# EAGLE design 6309 CPU Card v1 (EAGLE 4.16)
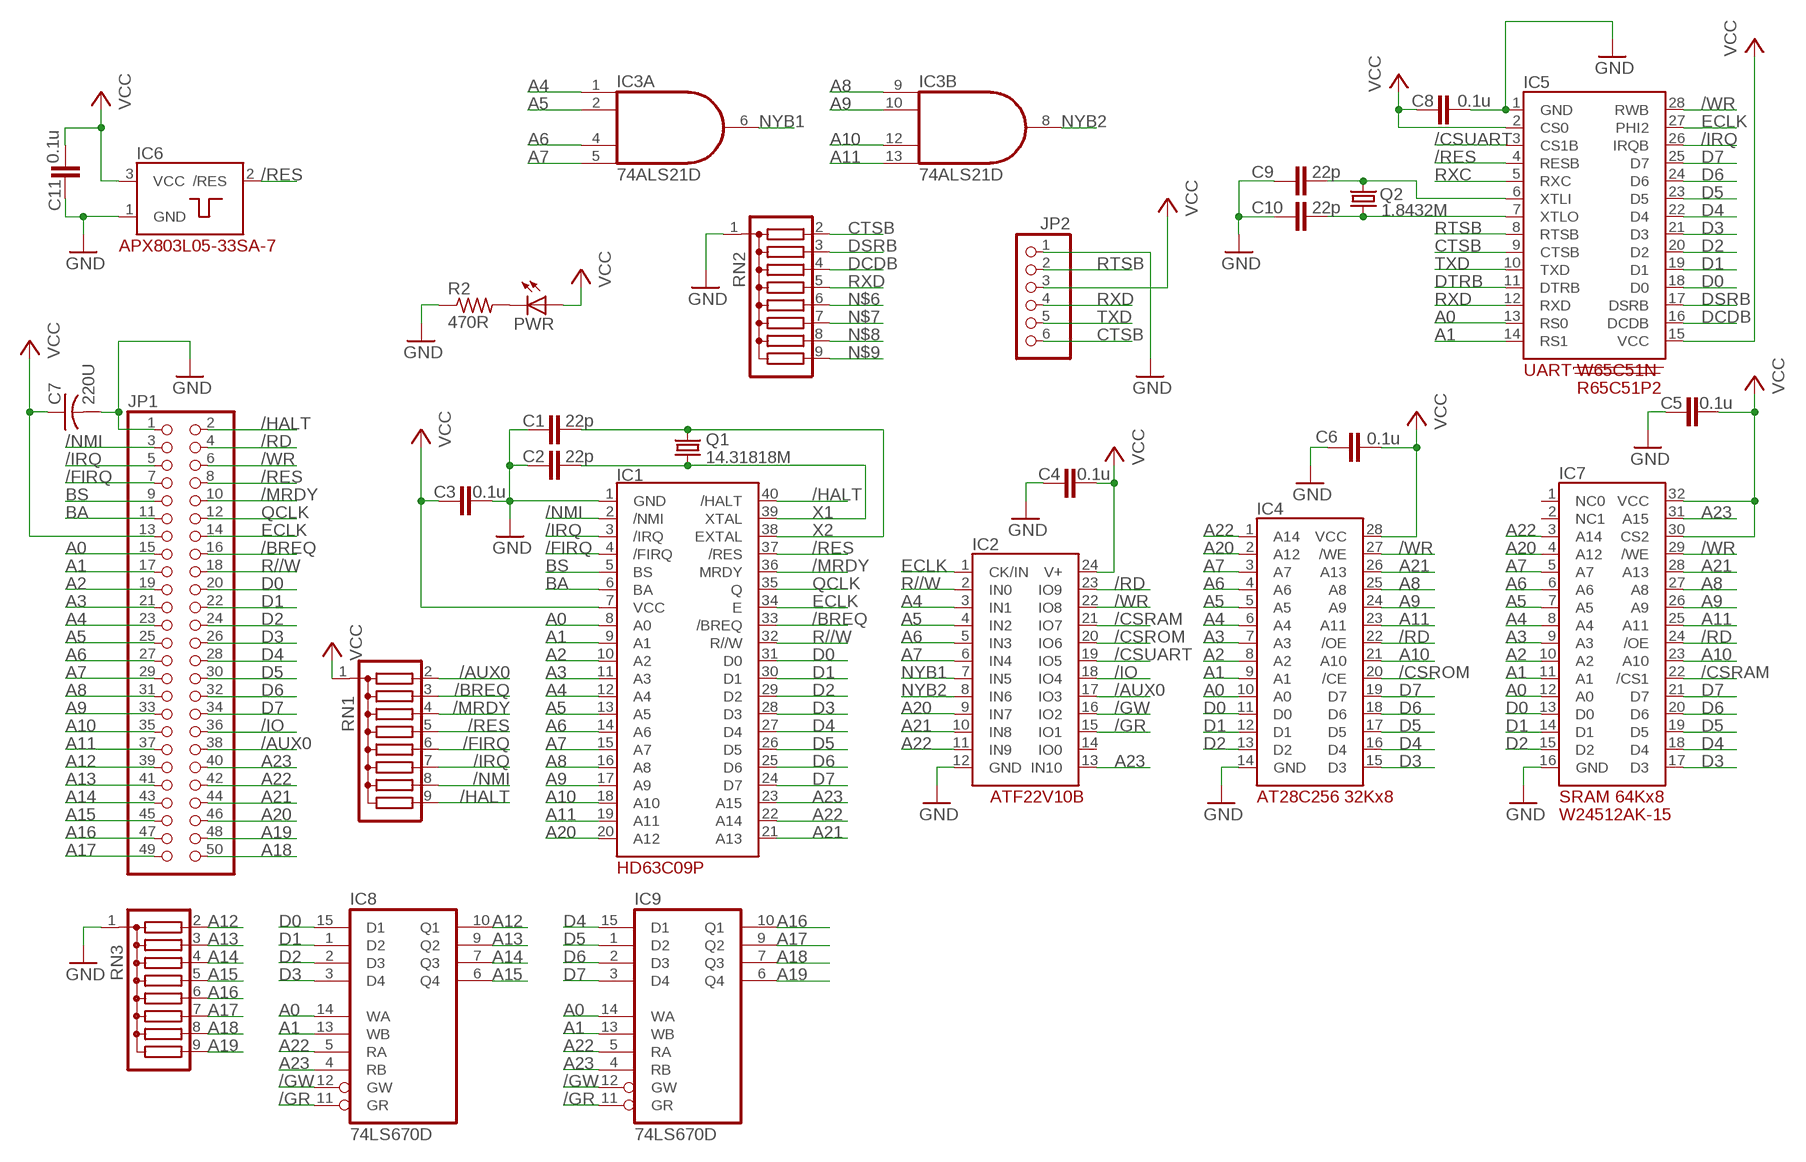
[diagram p0: schematic, sheet 1]

## Parts
C1  22p  C-EUC0603  [C0603]
C2  22p  C-EUC0603  [C0603]
C3  0.1u  C-EUC0603  [C0603]
C4  0.1u  C-EUC0603  [C0603]
C5  0.1u  C-EUC0603  [C0603]
C6  0.1u  C-EUC0603  [C0603]
C7  220U  C-US025-050X050  [C025-050X050]
C8  0.1u  C-EUC0603  [C0603]
C9  22p  C-EUC0603  [C0603]
C10  22p  C-EUC0603  [C0603]
C11  0.1u  C-EUC0603  [C0603]
IC1  HD63C09P  [DIL40]
IC2  PLD_ATF22V10B  [DIL24-3]
IC3  74ALS21D  [SO14]
IC4  EEP_32KX8_AT28C256  [DIL28-6]
IC5  UART_W65C51N  [DIL28-6]
IC6  POR_APX803L05-33SA-7  [SOT23]
IC7  SRAM_64KX8_W24512AK-15  [DIL32-3]
IC8  74LS670D  [SO16]
IC9  74LS670D  [SO16]
JP1  PINHD-2X25  [2X25]
JP2  PINHD-1X6  [1X06]
PWR  LED3MM  [LED3MM]
Q1  14.31818M  CRYSTALHC49S  [HC49/S]
Q2  1.8432M  CRYSTALHC49U-H  [HC49U-H]
R2  470R  R-US_R0603  [R0603]
RN1  G08R  [SIL9]
RN2  G08R  [SIL9]
RN3  G08R  [SIL9]

## Nets
/AUX0: IC2.17(IO3) JP1.38 RN1.2
/BREQ: IC1.33(/BREQ) JP1.16 RN1.3
/CSRAM: IC2.21(IO7) IC7.22(/CS1)
/CSROM: IC2.20(IO6) IC4.20(/CE)
/CSUART: IC2.19(IO5) IC5.3(CS1B)
/FIRQ: IC1.4(/FIRQ) JP1.7 RN1.6
/GR: IC2.15(IO1) IC8.11(GR) IC9.11(GR)
/GW: IC2.16(IO2) IC8.12(GW) IC9.12(GW)
/HALT: IC1.40(/HALT) JP1.2 RN1.9
/IO: IC2.18(IO4) JP1.36
/IRQ: IC1.3(/IRQ) IC5.26(IRQB) JP1.5 RN1.7
/MRDY: IC1.36(MRDY) JP1.10 RN1.4
/NMI: IC1.2(/NMI) JP1.3 RN1.8
/RD: IC2.23(IO9) IC4.22(/OE) IC7.24(/OE) JP1.4
/RES: IC1.37(/RES) IC5.4(RESB) IC6.2(/RES) JP1.8 RN1.5
/WR: IC2.22(IO8) IC4.27(/WE) IC5.28(RWB) IC7.29(/WE) JP1.6
A0: IC1.8(A0) IC4.10(A0) IC5.13(RS0) IC7.12(A0) IC8.14(WA) IC9.14(WA) JP1.15
A1: IC1.9(A1) IC4.9(A1) IC5.14(RS1) IC7.11(A1) IC8.13(WB) IC9.13(WB) JP1.17
A2: IC1.10(A2) IC4.8(A2) IC7.10(A2) JP1.19
A3: IC1.11(A3) IC4.7(A3) IC7.9(A3) JP1.21
A4: IC1.12(A4) IC2.3(IN1) IC3.1(A:I0) IC4.6(A4) IC7.8(A4) JP1.23
A5: IC1.13(A5) IC2.4(IN2) IC3.2(A:I1) IC4.5(A5) IC7.7(A5) JP1.25
A6: IC1.14(A6) IC2.5(IN3) IC3.4(A:I2) IC4.4(A6) IC7.6(A6) JP1.27
A7: IC1.15(A7) IC2.6(IN4) IC3.5(A:I3) IC4.3(A7) IC7.5(A7) JP1.29
A8: IC1.16(A8) IC3.9(B:I0) IC4.25(A8) IC7.27(A8) JP1.31
A9: IC1.17(A9) IC3.10(B:I1) IC4.24(A9) IC7.26(A9) JP1.33
A10: IC1.18(A10) IC3.12(B:I2) IC4.21(A10) IC7.23(A10) JP1.35
A11: IC1.19(A11) IC3.13(B:I3) IC4.23(A11) IC7.25(A11) JP1.37
A12: IC8.10(Q1) JP1.39 RN3.2
A13: IC8.9(Q2) JP1.41 RN3.3
A14: IC8.7(Q3) JP1.43 RN3.4
A15: IC8.6(Q4) JP1.45 RN3.5
A16: IC9.10(Q1) JP1.47 RN3.6
A17: IC9.9(Q2) JP1.49 RN3.7
A18: IC9.7(Q3) JP1.50 RN3.8
A19: IC9.6(Q4) JP1.48 RN3.9
A20: IC1.20(A12) IC2.9(IN7) IC4.2(A12) IC7.4(A12) JP1.46
A21: IC1.21(A13) IC2.10(IN8) IC4.26(A13) IC7.28(A13) JP1.44
A22: IC1.22(A14) IC2.11(IN9) IC4.1(A14) IC7.3(A14) IC8.5(RA) IC9.5(RA) JP1.42
A23: IC1.23(A15) IC2.13(IN10) IC7.31(A15) IC8.4(RB) IC9.4(RB) JP1.40
BA: IC1.6(BA) JP1.11
BS: IC1.5(BS) JP1.9
CTSB: IC5.9(CTSB) JP2.6 RN2.2
D0: IC1.31(D0) IC4.11(D0) IC5.18(D0) IC7.13(D0) IC8.15(D1) JP1.20
D1: IC1.30(D1) IC4.12(D1) IC5.19(D1) IC7.14(D1) IC8.1(D2) JP1.22
D2: IC1.29(D2) IC4.13(D2) IC5.20(D2) IC7.15(D2) IC8.2(D3) JP1.24
D3: IC1.28(D3) IC4.15(D3) IC5.21(D3) IC7.17(D3) IC8.3(D4) JP1.26
D4: IC1.27(D4) IC4.16(D4) IC5.22(D4) IC7.18(D4) IC9.15(D1) JP1.28
D5: IC1.26(D5) IC4.17(D5) IC5.23(D5) IC7.19(D5) IC9.1(D2) JP1.30
D6: IC1.25(D6) IC4.18(D6) IC5.24(D6) IC7.20(D6) IC9.2(D3) JP1.32
D7: IC1.24(D7) IC4.19(D7) IC5.25(D7) IC7.21(D7) IC9.3(D4) JP1.34
DCDB: IC5.16(DCDB) RN2.4
DSRB: IC5.17(DSRB) RN2.3
DTRB: IC5.11(DTRB)
ECLK: IC1.34(E) IC2.1(CK/IN) IC5.27(PHI2) JP1.14
GND [supply]: C1.1 C2.1 C3.2 C4.1 C5.1 C6.1 C7.2 C8.2 C9.1 C10.1 C11.2 IC1.1(GND) IC2.12(GND) IC4.14(GND) IC5.1(GND) IC6.1(GND) IC7.16(GND) JP1.1 JP2.1 R2.1 RN2.1 RN3.1
N$2: PWR.K(C) R2.2
N$6: RN2.6
N$7: RN2.7
N$8: RN2.8
N$9: RN2.9
N$20: C9.2 IC5.6(XTLI) Q2.2
N$21: C10.2 IC5.7(XTLO) Q2.1
NYB1: IC2.7(IN5) IC3.6(A:O)
NYB2: IC2.8(IN6) IC3.8(B:O)
QCLK: IC1.35(Q) JP1.12
R//W: IC1.32(R//W) IC2.2(IN0) JP1.18
RTSB: IC5.8(RTSB) JP2.2
RXC: IC5.5(RXC)
RXD: IC5.12(RXD) JP2.4 RN2.5
TXD: IC5.10(TXD) JP2.5
VCC [supply]: C3.1 C4.2 C5.2 C6.2 C7.1 C8.1 C11.1 IC1.7(VCC) IC2.24(V+) IC4.28(VCC) IC5.2(CS0) IC5.15(VCC) IC6.3(VCC) IC7.30(CS2) IC7.32(VCC) JP1.13 JP2.3 PWR.A RN1.1
X1: C2.2 IC1.39(XTAL) Q1.1
X2: C1.2 IC1.38(EXTAL) Q1.2
Unconnected: IC2.14(IO0) IC7.1(NC0) IC7.2(NC1)

## Notes on the sheet
- R65C51P2

## Power pins joined to a net without a drawn wire
GND: IC3.7(P:GND) IC8.8(GND) IC9.8(GND)
VCC: IC3.14(P:VCC) IC8.16(VCC) IC9.16(VCC)

## Library data of the parts
C1-C6 C8-C11 = rcl:C-EU: CAPACITOR, European symbol
C7 = rcl:C-US: CAPACITOR, American symbol
IC1 = 07-Retrocomputing:HD63C09P
IC2 = 07-Retrocomputing:PLD_ATF22V10B
IC3 = 74xx-us:74*21: Dual 4-input AND gate
IC4 = 07-Retrocomputing:EEP_32KX8_AT28C256
IC5 = 07-Retrocomputing:UART_W65C51N
IC6 = 07-Retrocomputing:POR_APX803L05-33SA-7
IC7 = 07-Retrocomputing:SRAM_64KX8_W24512AK-15
IC8 IC9 = 74xx-us:74*670: 4 by 4 REGISTER FILES, 3-state
JP1 = pinhead:PINHD-2X25: PIN HEADER
JP2 = pinhead:PINHD-1X6: PIN HEADER
PWR = led:LED: LED OSRAM: - CHIPLED LG R971, LG N971, LY N971, LG Q971, LY Q971, LO R971, LY R971 LH N974, LH R974 LS Q976, LO Q976, LY Q976 LO Q996 - Hyper CHIPLED LW Q18S LB Q993, LB Q99A, LB R99A - SideLED LS A670, LO A670, LY A670, LG A670, LP A670 LB A673, LV A673, LT A673, LW A673 LH A674 LY A675 LS A676, LA A676, LO A676, LY A676, LW A676 LS A679, LY A679, LG A679 - Hyper Micro SIDELED® LS Y876, LA Y876, LO Y876, LY Y876 LT Y87S - SmartLED LW L88C, LW L88S LB L89C, LB L89S, LG L890 LS L89K, LO L89K, LY L89K LS L896, LA L896, LO L896, LY L896 - TOPLED LS T670, LO T670, LY T670, LG T670, LP T670 LSG T670, LSP T670, LSY T670, LOP T670, LYG T670 LG T671, LOG T671, LSG T671 LB T673, LV T673, LT T673, LW T673 LH T674 LS T676, LA T676, LO T676, LY T676, LB T676, LH T676, LSB T676, LW T676 LB T67C, LV T67C, LT T67C, LS T67K, LO T67K, LY T67K, LW E67C LS E67B, LA E67B, LO E67B, LY E67B, LB E67C, LV E67C, LT E67C LW T67C LS T679, LY T679, LG T679 LS T770, LO T770, LY T770, LG T770, LP T770 LB T773, LV T773, LT T773, LW T773 LH T774 LS E675, LA E675, LY E675, LS T675 LS T776, LA T776, LO T776, LY T776, LB T776 LHGB T686 LT T68C, LB T68C - Hyper Mini TOPLED® LB M676 - Mini TOPLED Santana® LG M470 LS M47K, LO M47K, LY M47K Source: http://www.osram.convergy.de - LUMILED® LXK2-PW12-R00, LXK2-PW12-S00, LXK2-PW14-U00, LXK2-PW14-V00 LXK2-PM12-R00, LXK2-PM12-S00, LXK2-PM14-U00 LXK2-PE12-Q00, LXK2-PE12-R00, LXK2-PE12-S00, LXK2-PE14-T00, LXK2-PE14-U00 LXK2-PB12-K00, LXK2-PB12-L00, LXK2-PB12-M00, LXK2-PB14-N00, LXK2-PB14-P00, LXK2-PB14-Q00 LXK2-PR12-L00, LXK2-PR12-M00, LXK2-PR14-Q00, LXK2-PR14-R00 LXK2-PD12-Q00, LXK2-PD12-R00, LXK2-PD12-S00 LXK2-PH12-R00, LXK2-PH12-S00 LXK2-PL12-P00, LXK2-PL12-Q00, LXK2-PL12-R00 Source: www.luxeon.com
Q1 Q2 = crystal:CRYSTAL: CRYSTAL
R2 = rcl:R-US_: RESISTOR, American symbol
RN1-RN3 = resistor-sil:G08R: SIL RESISTOR

## Net classes
0 default: width 0.203 mm, drill 0.203 mm, clearance 0.254 mm
1 supply: width 0.61 mm, drill 0.203 mm, clearance 0.305 mm

## Board
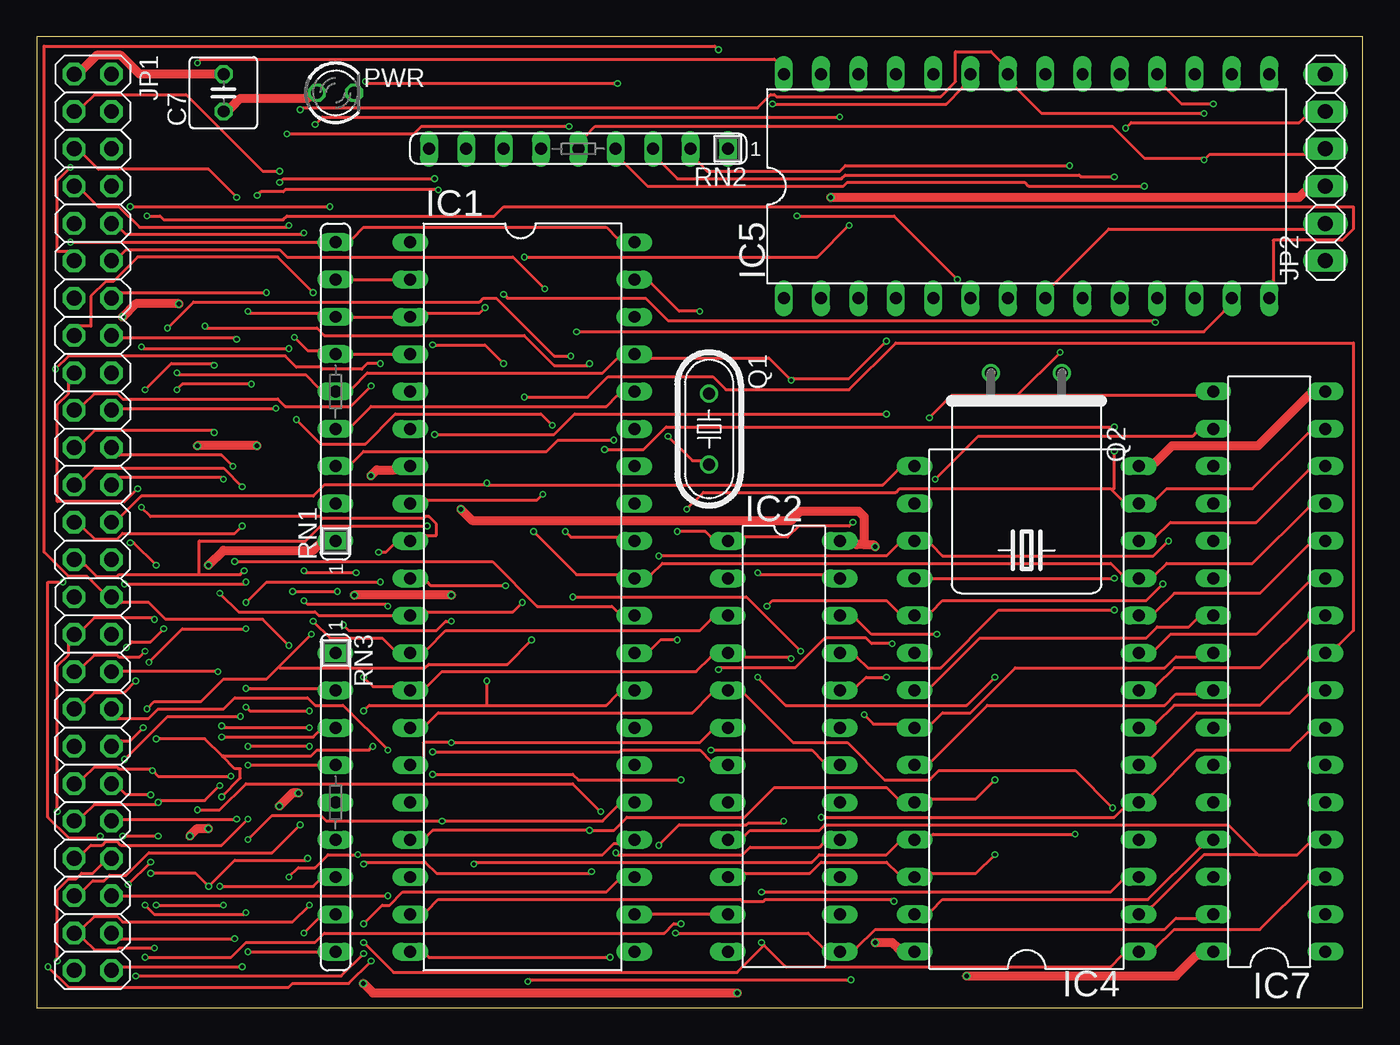
[diagram p1: board, top side]
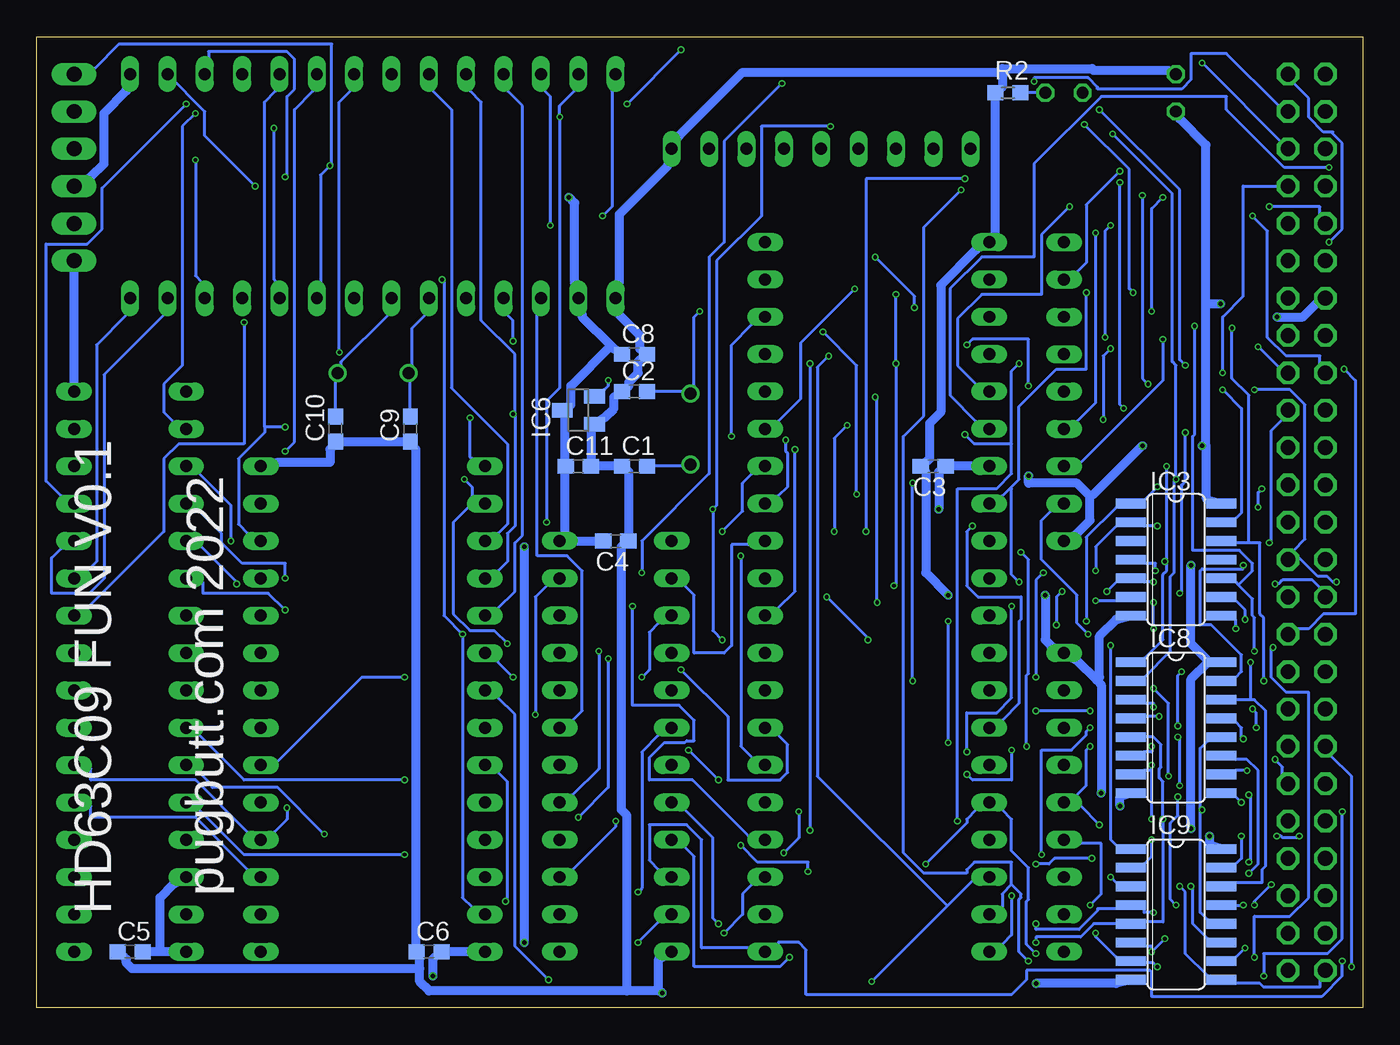
[diagram p2: board, bottom side, seen from below]

Size 90.17 x 66.04 mm. Coordinates in mm from the lower left corner, seen from the top.
Outline: 0,0 90.17,0 90.17,66.04 0,66.04 0,0
Copper layers (1*2*15*16): Top 0.0356mm / dielectric 0.1702mm / Route2 0.0178mm / dielectric 1.1938mm / Route15 0.0178mm / dielectric 0.1702mm / Bottom 0.0356mm
Design rules "oshpark-4layer": minimum track width 5mil, minimum drill 10mil, track to track 5mil, track to pad 5mil, pad to pad 5mil, via to via 5mil, smd to smd 5mil, copper to edge 15mil, drill to drill 6mil, minimum pad ring 4mil, minimum via ring 4mil, stop-mask expansion 2.5mil, vias tented up to drill 0mil, thermal gap 10mil

### Footprints (pad centres in the part's own frame; a part is rotated, then mirrored left to right if it is on the bottom)
C0603 = smd 1.1 x 1: 1 -0.85,0; 2 0.85,0
C025-050X050 = drill 0.813 octagon: 1 -1.27,0; 2 1.27,0
DIL40 = drill 0.813 long: 1 -24.13,-7.62; 2 -21.59,-7.62; 3 -19.05,-7.62; 4 -16.51,-7.62; 5 -13.97,-7.62; 6 -11.43,-7.62; 7 -8.89,-7.62; 8 -6.35,-7.62; 9 -3.81,-7.62; 10 -1.27,-7.62; 11 1.27,-7.62; 12 3.81,-7.62; 13 6.35,-7.62; 14 8.89,-7.62; 15 11.43,-7.62; 16 13.97,-7.62; 17 16.51,-7.62; 18 19.05,-7.62; 19 21.59,-7.62; 20 24.13,-7.62; 21 24.13,7.62; 22 21.59,7.62; 23 19.05,7.62; 24 16.51,7.62; 25 13.97,7.62; 26 11.43,7.62; 27 8.89,7.62; 28 6.35,7.62; 29 3.81,7.62; 30 1.27,7.62; 31 -1.27,7.62; 32 -3.81,7.62; 33 -6.35,7.62; 34 -8.89,7.62; 35 -11.43,7.62; 36 -13.97,7.62; 37 -16.51,7.62; 38 -19.05,7.62; 39 -21.59,7.62; 40 -24.13,7.62
DIL24-3 = drill 0.813 long: 1 -13.97,-3.81; 2 -11.43,-3.81; 3 -8.89,-3.81; 4 -6.35,-3.81; 5 -3.81,-3.81; 6 -1.27,-3.81; 7 1.27,-3.81; 8 3.81,-3.81; 9 6.35,-3.81; 10 8.89,-3.81; 11 11.43,-3.81; 12 13.97,-3.81; 13 13.97,3.81; 14 11.43,3.81; 15 8.89,3.81; 16 6.35,3.81; 17 3.81,3.81; 18 1.27,3.81; 19 -1.27,3.81; 20 -3.81,3.81; 21 -6.35,3.81; 22 -8.89,3.81; 23 -11.43,3.81; 24 -13.97,3.81
SO14 = smd 0.66 x 2.032: 1 -3.81,-3.073; 2 -2.54,-3.073; 3 -1.27,-3.073; 4 0,-3.073; 5 1.27,-3.073; 6 2.54,-3.073; 7 3.81,-3.073; 8 3.81,3.073; 9 2.54,3.073; 10 1.27,3.073; 11 0,3.073; 12 -1.27,3.073; 13 -2.54,3.073; 14 -3.81,3.073
DIL28-6 = drill 0.813 long: 1 -16.51,-7.62; 2 -13.97,-7.62; 3 -11.43,-7.62; 4 -8.89,-7.62; 5 -6.35,-7.62; 6 -3.81,-7.62; 7 -1.27,-7.62; 8 1.27,-7.62; 9 3.81,-7.62; 10 6.35,-7.62; 11 8.89,-7.62; 12 11.43,-7.62; 13 13.97,-7.62; 14 16.51,-7.62; 15 16.51,7.62; 16 13.97,7.62; 17 11.43,7.62; 18 8.89,7.62; 19 6.35,7.62; 20 3.81,7.62; 21 1.27,7.62; 22 -1.27,7.62; 23 -3.81,7.62; 24 -6.35,7.62; 25 -8.89,7.62; 26 -11.43,7.62; 27 -13.97,7.62; 28 -16.51,7.62
SOT23 = smd 1 x 1.4: 1 -0.95,-1.1; 2 0.95,-1.1; 3 0,1.1
DIL32-3 = drill 0.813 long: 1 -19.05,-3.81; 2 -16.51,-3.81; 3 -13.97,-3.81; 4 -11.43,-3.81; 5 -8.89,-3.81; 6 -6.35,-3.81; 7 -3.81,-3.81; 8 -1.27,-3.81; 9 1.27,-3.81; 10 3.81,-3.81; 11 6.35,-3.81; 12 8.89,-3.81; 13 11.43,-3.81; 14 13.97,-3.81; 15 16.51,-3.81; 16 19.05,-3.81; 17 19.05,3.81; 18 16.51,3.81; 19 13.97,3.81; 20 11.43,3.81; 21 8.89,3.81; 22 6.35,3.81; 23 3.81,3.81; 24 1.27,3.81; 25 -1.27,3.81; 26 -3.81,3.81; 27 -6.35,3.81; 28 -8.89,3.81; 29 -11.43,3.81; 30 -13.97,3.81; 31 -16.51,3.81; 32 -19.05,3.81
SO16 = smd 0.66 x 2.032: 1 -4.445,-3.073; 2 -3.175,-3.073; 3 -1.905,-3.073; 4 -0.635,-3.073; 5 0.635,-3.073; 6 1.905,-3.073; 7 3.175,-3.073; 8 4.445,-3.073; 9 4.445,3.073; 10 3.175,3.073; 11 1.905,3.073; 12 0.635,3.073; 13 -0.635,3.073; 14 -1.905,3.073; 15 -3.175,3.073; 16 -4.445,3.073
2X25 = drill 1.016 octagon: 1 -30.48,-1.27; 2 -30.48,1.27; 3 -27.94,-1.27; 4 -27.94,1.27; 5 -25.4,-1.27; 6 -25.4,1.27; 7 -22.86,-1.27; 8 -22.86,1.27; 9 -20.32,-1.27; 10 -20.32,1.27; 11 -17.78,-1.27; 12 -17.78,1.27; 13 -15.24,-1.27; 14 -15.24,1.27; 15 -12.7,-1.27; 16 -12.7,1.27; 17 -10.16,-1.27; 18 -10.16,1.27; 19 -7.62,-1.27; 20 -7.62,1.27; 21 -5.08,-1.27; 22 -5.08,1.27; 23 -2.54,-1.27; 24 -2.54,1.27; 25 0,-1.27; 26 0,1.27; 27 2.54,-1.27; 28 2.54,1.27; 29 5.08,-1.27; 30 5.08,1.27; 31 7.62,-1.27; 32 7.62,1.27; 33 10.16,-1.27; 34 10.16,1.27; 35 12.7,-1.27; 36 12.7,1.27; 37 15.24,-1.27; 38 15.24,1.27; 39 17.78,-1.27; 40 17.78,1.27; 41 20.32,-1.27; 42 20.32,1.27; 43 22.86,-1.27; 44 22.86,1.27; 45 25.4,-1.27; 46 25.4,1.27; 47 27.94,-1.27; 48 27.94,1.27; 49 30.48,-1.27; 50 30.48,1.27
1X06 = drill 1.016 long: 1 -6.35,0; 2 -3.81,0; 3 -1.27,0; 4 1.27,0; 5 3.81,0; 6 6.35,0
LED3MM = drill 0.813 octagon: A -1.27,0; K 1.27,0
HC49/S = drill 0.813 round: 1 -2.413,0; 2 2.413,0
HC49U-H = drill 0.813 round: 1 -2.413,-5.08; 2 2.413,-5.08
R0603 = smd 1.1 x 1: 1 -0.85,0; 2 0.85,0
SIL9 = drill 0.813 long: 1 -10.16,0; 2 -7.62,0; 3 -5.08,0; 4 -2.54,0; 5 0,0; 6 2.54,0; 7 5.08,0; 8 7.62,0; 9 10.16,0

### Placement (x,y rotation side)
C1  49.53,36.83 0 bottom
C2  49.53,41.91 0 bottom
C3  29.21,36.83 180 bottom
C4  50.8,31.75 180 bottom
C5  83.82,3.81 0 bottom
C6  63.5,3.81 0 bottom
C7  12.7,62.23 90 top
C8  49.53,44.45 0 bottom
C9  64.77,39.37 90 bottom
C10  69.85,39.37 90 bottom
C11  53.34,36.83 0 bottom
IC1  33.02,27.94 270 top
IC2  50.8,17.78 270 top
IC3  12.7,30.48 270 bottom
IC4  67.31,20.32 90 top
IC5  67.31,55.88 0 top
IC6  53.34,40.64 90 bottom
IC7  83.82,22.86 90 top
IC8  12.7,19.05 270 bottom
IC9  12.7,6.35 270 bottom
JP1  3.81,33.02 270 top
JP2  87.63,57.15 90 top
PWR  20.32,62.23 0 top
Q1  45.72,39.37 270 top
Q2  67.31,38.1 180 top
R2  24.13,62.23 0 bottom
RN1  20.32,41.91 90 top
RN2  36.83,58.42 180 top
RN3  20.32,13.97 270 top

### Tracks (layer width: path | path; a pad name or v marks a point on that pad's centre or on a via)
/AUX0  (via drill 0.25)
  Top 0.203: 16.45,23.18 15.62,22.35 12.7,22.35 11.18,20.83 8,20.83 v7.49,20.32 | 16.45,23.18 v18.67,25.4 | v7.24,19.05 6.35,18.16 5.71,18.16 JP1.38 | v51.94,24.26 48.26,27.94 v36.45,27.94 | v33.66,25.02 32,23.37 26.67,23.37 26.42,23.11 16.51,23.11 16.45,23.18
  Bottom 0.203: v18.67,25.4 19.43,26.16 19.43,28.07 21.84,30.48 21.84,33.15 21.21,33.78 RN1.2 | v7.49,20.32 7.24,20.07 v7.24,19.05 | v51.94,24.26 51.94,16.26 53.72,14.48 IC2.17 | v36.45,27.94 33.66,25.15 v33.66,25.02
/BREQ  (via drill 0.25)
  Top 0.203: v13.59,45.47 13.46,45.59 5.71,45.59 JP1.16 | v39.24,38.61 35.43,38.61 34.67,37.85 22.23,37.85 21.46,37.08 RN1.3
  Bottom 0.203: v13.59,45.47 13.59,42.67 19.18,37.08 RN1.3 | v39.24,38.61 39.24,37.85 39.12,37.72 39.12,35.43 39.75,34.8 IC1.33
/CSRAM  (via drill 0.25)
  Top 0.203: v73.28,27.05 65.41,27.05 61.47,23.11 56.52,23.11 55.75,23.88 IC2.21
  Bottom 0.203: v73.28,27.05 74.42,28.19 78.87,28.19 78.87,28.96 IC7.22
/CSROM  (via drill 0.25)
  Top 0.203: v57.78,22.48 56.39,22.48 55.75,21.84 IC2.20
  Bottom 0.203: v57.78,22.48 58.8,23.5 58.8,23.62 IC4.20
/CSUART
  Bottom 0.203: IC2.19 53.72,19.56 53.09,20.19 53.09,29.72 54.1,30.73 56.13,30.73 56.13,47.12 IC5.3
/FIRQ  (via drill 0.25)
  Top 0.203: IC1.4 RN1.6 19.18,44.7 18.41,44.7 v17.53,45.59 | v17.14,53.21 17.02,53.09 6.99,53.09 5.59,54.48 4.19,54.48 3.17,55.5 JP1.7
  Bottom 0.203: v17.14,53.21 17.53,52.83 v17.53,45.59
/GR  (via drill 0.25)
  Top 0.203: v7.75,9.14 10.79,9.14 v11.68,8.26 13.46,10.03 18.29,10.03 v18.41,10.16 | v50.8,12.7 50.67,12.57 48.39,12.57 48.26,12.45 43.69,12.45 v42.29,11.05 | v37.72,9.27 37.59,9.14 27.18,9.14 26.42,9.91 22.35,9.91 v22.23,9.78
  Bottom 0.203: v11.68,8.26 11.56,8.13 11.56,5.71 10.54,4.7 IC9.11 | v7.75,9.14 7.11,9.78 7.11,16.13 7.87,16.89 8.64,16.89 IC8.11 | v50.8,12.7 50.8,12.32 53.72,9.4 IC2.15 | v42.29,11.05 41.15,9.91 37.72,9.91 v37.72,9.27 | v22.23,9.78 21.34,9.78 20.95,10.16 v18.41,10.16
/GW  (via drill 0.25)
  Top 0.203: v39.37,10.54 39.5,10.41 48.01,10.41 48.51,10.92 53.21,10.92 53.47,11.18 IC2.16 | v38.35,13.34 36.45,15.24 14.22,15.24 12.45,13.46 v10.92,13.46
  Bottom 0.203: 11.05,13.46 11.05,17.65 10.54,18.16 IC8.12 | 11.05,13.46 11.05,6.48 10.54,5.97 IC9.12 | v39.37,10.54 38.35,11.56 v38.35,13.34 | 11.05,13.46 v10.92,13.46
/HALT  (via drill 0.25)
  Top 0.203: IC1.40 39.5,52.32 38.73,53.09 22.23,53.09 21.46,52.32 RN1.9 v2.29,52.07
  Bottom 0.203: v2.29,52.07 1.4,52.96 1.4,58.8 2.03,59.44 2.03,59.56 2.67,59.56 3.68,60.58 3.68,61.85 4.7,62.87 JP1.2
/IO  (via drill 0.25)
  Top 0.203: v45.85,17.53 52.7,17.53 53.47,16.76 IC2.18 | v43.81,15.49 36.83,15.49 36.45,15.88 v26.92,15.88 | v23.88,17.53 20.83,20.57 18.92,20.57 18.41,21.08 13.46,21.08 12.7,20.32 8.26,20.32 7.62,19.68 5.46,19.68 JP1.36
  Bottom 0.203: v43.81,15.49 v45.85,17.53 | v26.92,15.88 26.54,15.49 23.88,15.49 v23.88,17.53
/IRQ  (via drill 0.25)
  Top 0.203: v55.24,53.21 53.09,51.05 v33.15,51.05 | v30.48,47.62 30.1,47.24 26.54,47.24 IC1.3 RN1.7 19.18,47.24 14.48,47.24 v14.35,47.37 | v13.59,55.12 11.68,57.02 4.19,57.02 3.17,58.04 JP1.5
  Bottom 0.203: v55.24,53.21 55.24,61.98 55.63,62.36 IC5.26 | v33.15,51.05 30.48,48.39 v30.48,47.62 | v13.59,55.12 14.35,54.36 v14.35,47.37
/MRDY  (via drill 0.25)
  Top 0.203: RN1.4 21.46,39.62 22.73,40.89 38.73,40.89 39.5,41.66 IC1.36 | v18.16,52.7 18.03,52.58 6.1,52.58 5.71,52.96 JP1.10
  Bottom 0.203: v18.16,52.7 18.16,41.15 19.43,39.88 RN1.4
/NMI  (via drill 0.25)
  Top 0.203: RN1.8 IC1.2 | v16.51,56.9 15.37,56.9 10.16,62.1 3.94,62.1 3.17,61.34 JP1.3
  Bottom 0.203: v16.51,56.9 18.8,54.61 18.8,50.67 19.43,50.04 RN1.8
/RD  (via drill 0.25)
  Top 0.203: IC7.24 78.87,23.88 77.47,23.88 76.71,23.11 66.55,23.11 63.5,20.07 61.59,20.07 60.83,19.3 IC4.22 58.55,19.3 56.9,19.3 v56.26,19.94 | v22.35,62.99 22.48,62.87 v39.5,62.87 | v49.02,29.59 49.15,29.46 53.47,29.46 IC2.23
  Bottom 0.203: v56.26,19.94 56.26,27.94 55.5,28.7 IC2.23 | v22.35,62.99 22.35,63.25 18.67,63.25 18.03,62.61 18.03,62.48 12.32,62.48 11.68,63.12 11.68,64.9 9.27,64.9 5.71,61.34 JP1.4 | v39.5,62.87 43.43,58.93 43.43,52.07 44.45,51.05 44.45,36.32 49.02,31.75 v49.02,29.59
/RES  (via drill 0.25)
  Top 0.203: v57.78,45.34 55.24,42.8 51.44,42.8 v51.31,42.67 49.78,44.2 41.78,44.2 IC1.37 39.5,44.2 38.48,43.18 22.48,43.18 21.46,42.16 RN1.5 19.18,42.16 18.29,43.05 9.65,43.05 v9.53,43.18
  Bottom 0.203: v51.31,42.67 51.31,42.29 51.56,42.04 IC6.2 | v57.78,45.34 57.78,46.74 58.17,47.12 IC5.4 | v9.53,43.18 9.53,46.99 8.13,48.39 8.13,55.88 JP1.8
/WR  (via drill 0.25)
  Top 0.203: IC4.27 60.83,6.6 61.59,7.37 75.56,7.37 79.12,10.92 IC7.29 | v61.21,25.4 56.77,25.4 55.75,26.42 IC2.22 | v10.92,64.26 11.18,64.52 50.16,64.52 50.29,64.39 IC5.28 | v62.61,49.53 58.29,53.85 v51.69,53.85
  Bottom 0.203: IC4.27 60.58,6.86 61.21,7.49 v61.21,25.4 62.48,26.67 62.48,49.4 v62.61,49.53 | JP1.6 v10.92,64.26 | v51.69,53.85 51.05,54.48 51.05,62.36 IC5.28
A0  (via drill 0.25)
  Top 0.203: IC4.10 76.07,26.92 77.34,28.19 83.19,28.19 86.49,31.5 IC7.12 | v18.8,48.64 16.38,51.05 6.86,51.05 5.21,49.4 4.7,49.4 3.68,48.39 3.68,46.35 2.92,46.35 JP1.15 | v7.62,23.5 9.91,25.78 v14.22,25.78 | v14.22,27.56 15.62,28.96 v23.37,28.96 | v36.7,45.97 79.38,45.97 80.77,47.37 IC5.13 | v34.42,34.92 34.04,34.54 26.54,34.54 IC1.8
  Bottom 0.203: IC5.13 81.53,47.12 85.6,43.05 85.6,29.21 86.61,28.19 89.15,28.19 89.15,30.61 88.52,31.24 IC7.12 | 7.62,20.95 7.37,20.95 6.6,20.19 6.6,9.65 6.86,9.4 6.86,8.51 8.64,8.51 IC9.14 | 7.62,20.95 IC8.14 | 23.94,35.37 23.37,35.94 23.37,40.89 20.83,43.43 18.8,43.43 v18.8,48.64 | 23.94,35.37 24.51,34.8 IC1.8 | 7.62,20.95 v7.62,23.5 | v14.22,25.78 v14.22,27.56 | v23.37,28.96 23.88,29.46 23.88,35.31 23.94,35.37 | v36.7,45.97 34.42,43.69 v34.42,34.92
A1  (via drill 0.25)
  Top 0.203: IC4.9 76.07,24.38 77.09,25.4 82.93,25.4 86.49,28.96 IC7.11 | v8.13,6.99 v12.7,6.99 | v12.57,14.35 13.84,15.62 13.84,16.26 13.46,16.26 12.64,17.08 | 12.64,17.08 11.43,18.29 v8.13,18.29 | v23.24,30.99 23.75,30.99 24.26,31.5 IC1.9 26.42,32.13 27.18,32.13 27.18,32.89 26.67,33.4 26.42,33.4 26.29,33.27 19.43,33.27 19.3,33.4 7.75,33.4 v7.11,34.04 | v22.86,17.78 22.61,17.53 19.05,17.53 18.67,17.14 12.7,17.14 12.64,17.08 | v6.86,35.31 5.97,34.42 1.4,34.42 1.4,41.02 2.16,41.78 2.16,42.55 JP1.17 | v7.49,53.85 8.38,53.85 8.64,53.59 16.76,53.59 17.02,53.85 31.11,53.85 31.75,54.48 89.53,54.48 89.53,52.96 88.77,52.2 84.07,52.2 84.07,49.4 IC5.14
  Bottom 0.203: IC5.14 84.07,47.12 86.11,45.09 86.11,30.35 86.74,29.72 IC7.11 | v12.7,6.99 13.08,7.37 13.08,12.57 12.57,13.08 v12.57,14.35 | v8.13,18.29 8.26,18.41 8.26,19.05 8.64,19.43 IC8.13 | IC9.13 v8.13,6.99 | v23.24,30.99 22.73,30.48 22.73,22.73 22.86,22.61 v22.86,17.78 | v6.86,35.31 7.11,35.05 v7.11,34.04 | v7.49,53.85 6.48,52.83 6.48,45.59 5.21,44.32 2.92,44.32 2.92,43.81 JP1.17
A2  (via drill 0.25)
  Top 0.203: IC4.8 76.07,21.84 77.34,23.11 83.19,23.11 86.49,26.42 IC7.10 | v31.88,28.7 26.8,28.7 26.54,28.96 IC1.10 | v31.75,43.81 30.48,45.09 v26.92,45.09 | v22.73,42.29 21.34,40.89 16.89,40.89 16.38,41.4 5.84,41.4 5.46,41.78 3.94,41.78 3.17,41.02 JP1.19 | v76.07,46.61 75.95,46.74 42.93,46.74 41.4,48.26 32,48.26 v31.75,48.51
  Bottom 0.203: v31.88,28.7 31.75,28.83 v31.75,43.81 v31.75,48.51 | v26.92,45.09 26.54,45.47 22.73,45.47 v22.73,42.29 | v76.07,46.61 76.07,38.35 80.52,38.35 81.53,37.34 81.53,32.38 86.74,27.18 IC7.10
A3  (via drill 0.25)
  Top 0.203: IC4.7 76.07,19.3 77.34,20.57 83.19,20.57 86.49,23.88 IC7.9 88.52,24.64 89.53,25.65 89.53,45.21 58.42,45.21 55.24,42.04 46.86,42.04 45.97,42.93 38.86,42.93 37.47,41.53 v33.15,41.53 | v12.45,28.19 13.72,26.92 18.92,26.92 19.18,26.67 IC1.11 26.54,26.92 32.38,26.92 v33.02,27.56 | v12.06,39.12 11.94,39.24 3.94,39.24 3.17,38.48 JP1.21
  Bottom 0.203: v12.45,28.19 12.32,28.32 12.32,35.56 12.06,35.81 v12.06,39.12 | v33.15,41.53 33.02,41.4 v33.02,27.56
A4  (via drill 0.25)
  Top 0.203: IC4.6 75.82,17.02 78.87,20.07 85.22,20.07 86.49,21.34 IC7.8 | v13.97,35.43 12.7,36.7 3.94,36.7 3.17,35.94 JP1.23 | IC2.3 45.85,26.42 45.09,25.65 27.81,25.65 26.54,24.38 IC1.12 24.26,24.38 23.5,25.15 19.94,25.15 v18.8,26.29 | v65.15,22.48 63.25,20.57 50.93,20.57 v49.02,22.48
  Bottom 0.203: v13.97,35.43 14.86,34.54 IC3.1 16.76,34.04 18.8,32 v18.8,26.29 | v65.15,22.48 68.07,22.48 73.79,16.76 IC4.6 | v49.02,22.48 48.51,22.99 48.51,25.53 47.88,26.16 IC2.3
A5  (via drill 0.25)
  Top 0.203: IC7.7 86.49,18.8 85.22,17.53 78.87,17.53 75.82,14.48 IC4.5 73.91,13.59 73.28,12.95 v53.34,12.95 | v13.97,32.77 13.46,32.26 5.84,32.26 5.46,31.88 3.94,31.88 3.17,32.64 JP1.25 | v18.16,29.72 18.29,29.59 v21.72,29.59 | v22.23,22.48 22.86,21.84 24.26,21.84 IC1.13 26.54,21.84 27.56,22.86 44.83,22.86 45.85,23.88 IC2.4 48.13,23.88 51.18,23.88 v51.31,23.75
  Bottom 0.203: v13.97,32.77 14.86,32.77 IC3.2 16.76,32.77 18.16,31.37 v18.16,29.72 | v21.72,29.59 22.23,29.08 v22.23,22.48 | v53.34,12.95 51.31,14.99 v51.31,23.75
A6  (via drill 0.25)
  Top 0.203: v14.1,29.72 13.84,29.46 11.05,29.46 | 11.05,29.46 5.59,29.46 5.46,29.34 4.06,29.34 3.3,30.1 3.17,30.1 JP1.27 | IC1.14 26.54,19.3 27.3,20.07 44.58,20.07 45.85,21.34 IC2.5 48.13,21.34 51.44,18.03 55.12,18.03 57.66,15.49 60.71,15.49 61.34,16.13 70.61,16.13 v73.15,13.59 | 11.05,29.46 11.05,31.75 18.29,31.75 19.3,32.77 v26.54,32.77
  Bottom 0.203: IC7.6 86.49,16.26 86.49,15.49 79.38,15.49 75.82,11.94 IC4.4 74.04,11.94 73.15,12.83 v73.15,13.59 | v14.1,29.72 14.1,30.23 14.86,30.23 IC3.4 | v26.54,32.77 26.92,32.38 26.92,28.7 26.16,27.94 23.24,27.94 23.24,26.42 23.37,26.29 23.37,20.7 24.51,19.56 IC1.14
A7  (via drill 0.25)
  Top 0.203: v14.22,28.96 14.1,28.83 v5.97,28.83 | IC1.15 26.29,17.02 26.29,18.03 v28.19,18.03 45.09,18.03 45.85,18.8 IC2.6 | v17.4,28.32 v20.45,28.32 | v20.83,26.04 21.21,25.65 27.18,25.65 27.81,26.29 v28.19,26.29 | v49.28,7.87 73.03,7.87 73.79,8.64 IC4.3
  Bottom 0.203: IC4.3 75.82,9.4 79.38,12.95 86.49,12.95 86.49,13.72 IC7.5 | v14.22,28.96 14.86,28.96 IC3.5 16.76,28.96 v17.4,28.32 | v5.97,28.83 5.71,28.83 5.46,29.08 3.43,29.08 2.92,28.57 JP1.29 | v20.45,28.32 20.83,27.94 v20.83,26.04 | v28.19,26.29 v28.19,18.03 | v49.28,7.87 49.02,8.13 49.02,17.4 47.88,18.54 IC2.6
A8  (via drill 0.25)
  Top 0.203: v8,26.42 7.87,26.54 3.94,26.54 3.17,25.78 JP1.31 2.16,24.77 2.16,24 1.4,23.24 v1.4,13.34 | v70.61,11.81 60.96,11.81 60.83,11.68 IC4.25 58.55,11.18 57.78,10.41 53.21,10.41 52.7,9.91 29.84,9.91 v29.72,9.78 | v6.73,2.16 20.7,2.16 v22.23,3.68
  Bottom 0.203: v8,26.42 8,27.05 8.64,27.69 IC3.9 | v70.61,11.81 73.79,14.99 78.23,14.99 78.23,15.11 79.12,16 IC7.27 | v29.72,9.78 26.92,12.57 26.92,12.83 26.29,13.46 IC1.16 24.51,13.46 23.88,12.83 23.88,10.67 22.73,9.53 22.73,7.37 22.86,7.24 22.86,4.32 v22.23,3.68 | v1.4,13.34 1.4,4.7 2.41,3.68 6.73,3.68 v6.73,2.16
A9  (via drill 0.25)
  Top 0.203: v7.37,24.26 6.99,23.88 5.59,23.88 5.46,24 3.94,24 3.17,23.24 JP1.33 | IC1.17 26.54,11.68 26.92,12.06 v37.59,12.06 39.24,12.06 40.13,12.95 48.13,12.95 50.16,14.99 57.78,14.99 58.55,14.22 IC4.24 60.83,14.22 63.88,14.22 v65.15,15.49 | v11.43,46.35 11.56,46.23 19.05,46.23 19.56,45.72 33.15,45.72 35.18,43.69 37.47,43.69 v37.59,43.81
  Bottom 0.203: 8.45,28.77 7.49,27.81 7.49,26.67 7.37,26.54 v7.37,24.26 | 8.45,28.77 8.64,28.96 IC3.10 | v65.15,15.49 76.07,15.49 79.12,18.54 IC7.26 | v11.43,46.35 11.43,38.99 11.56,38.86 11.56,31.11 8.38,31.11 7.49,30.23 7.49,29.72 8.45,28.77 | v37.59,43.81 v37.59,12.06
A10  (via drill 0.25)
  Top 0.203: v6.73,22.23 5.97,21.46 3.94,21.46 3.17,20.7 JP1.35 | v33.4,1.78 33.53,1.91 v55.37,1.91 | IC7.23 78.87,26.42 78.36,25.91 76.2,25.91 75.44,25.15 64.14,25.15 60.83,21.84 IC4.21 | v8.89,46.23 10.67,48.01 30.1,48.01 30.35,48.26 31.24,48.26 35.18,44.32 v36.32,44.32
  Bottom 0.203: 7.75,31.62 6.99,31.62 6.99,26.8 6.73,26.54 v6.73,22.23 | 7.75,31.62 8.64,31.62 IC3.12 | 28.26,6.92 v33.4,1.78 | 28.26,6.92 26.54,8.64 IC1.18 | v55.37,1.91 57.66,4.19 57.66,19.94 58.8,21.08 IC4.21 | 7.75,31.62 7.75,41.66 8.89,42.8 v8.89,46.23 | v36.32,44.32 37.08,43.56 37.08,15.75 28.26,6.92
A11  (via drill 0.25)
  Top 0.203: IC4.23 60.83,16.76 64.64,20.57 76.71,20.57 77.47,21.34 78.87,21.34 IC7.25 | v9.53,42.04 9.91,42.42 v14.61,42.42 | v14.99,55.24 15.24,55.5 16.76,55.5 16.89,55.63 v27.3,55.63 | v0.76,2.79 2.16,1.4 17.14,1.4 17.4,1.65 21.21,1.65 v22.73,3.17 | v58.29,7.24 58.17,7.37 49.53,7.37 49.4,7.24 48.01,7.24 47.88,7.37 27.3,7.37 26.54,6.6 IC1.19
  Bottom 0.203: v9.53,42.04 8.26,40.77 8.26,33.66 8.64,33.27 IC3.13 | v14.61,42.42 14.99,42.8 v14.99,55.24 | v27.3,55.63 29.84,53.09 29.84,40.26 31.24,38.86 31.24,10.54 29.84,9.14 26.92,9.14 26.92,9.4 26.42,9.91 23.88,9.91 23.88,8.38 | 23.88,8.38 24.51,7.75 24.51,6.86 IC1.19 | v0.76,2.79 0.76,15.75 2.16,17.14 JP1.37 | v22.73,3.17 23.37,3.81 23.37,7.37 23.24,7.49 23.24,7.75 23.88,8.38 | v58.29,7.24 58.17,7.37 58.17,15.37 58.8,16 IC4.23
A12  (via drill 0.25)
  Top 0.203: JP1.39 3.17,15.62 3.94,16.38 5.46,16.38 5.59,16.26 7.75,16.26 v7.87,16.13 8.26,15.75 v13.21,15.75 | v14.22,21.72 19.18,21.72 RN3.2
  Bottom 0.203: v7.87,16.13 8.64,16.13 IC8.10 | v14.22,21.72 13.21,20.7 v13.21,15.75
A13  (via drill 0.25)
  Top 0.203: JP1.41 3.17,13.08 3.94,13.84 8.13,13.84 v8.26,13.97 8.38,14.1 11.43,14.1 v12.45,15.11 | v12.57,18.41 18.8,18.41 19.18,18.8 RN3.3
  Bottom 0.203: v8.26,13.97 8.64,14.35 IC8.9 | v12.57,18.41 12.45,18.29 v12.45,15.11
A14  (via drill 0.25)
  Top 0.203: v14.35,16.51 RN3.4 | v14.35,12.83 12.57,11.05 5.71,11.05 5.46,11.3 4.7,11.3 4.45,11.05 3.68,11.05 3.17,10.54 JP1.43
  Bottom 0.203: 14.35,16.13 14.86,16.13 IC8.7 | 14.35,16.13 v14.35,16.51 | v14.35,12.83 14.35,16.13
A15  (via drill 0.25)
  Top 0.203: v18.54,17.78 v14.35,17.78 | v17.91,12.45 16,10.54 7.62,10.54 6.1,9.02 4.95,9.02 4.57,8.64 3.81,8.64 3.17,8 JP1.45
  Bottom 0.203: v14.35,17.78 14.35,17.4 14.86,17.4 IC8.6 | v18.54,17.78 18.8,17.53 18.8,15.11 19.43,14.48 RN3.5 19.18,13.72 v17.91,12.45
A16  (via drill 0.25)
  Top 0.203: v8,4.06 5.59,4.06 5.46,3.94 3.94,3.94 3.17,4.7 JP1.47 3.17,5.46 3.94,6.22 5.46,6.22 5.84,5.84 17.4,5.84 v18.54,6.99
  Bottom 0.203: v8,4.06 8.64,3.43 IC9.10 | v18.54,6.99 17.78,7.75 17.78,11.18 19.18,11.18 RN3.6
A17  (via drill 0.25)
  Top 0.203: v12.45,8.26 18.8,8.26 19.18,8.64 RN3.7
  Bottom 0.203: JP1.49 2.92,1.91 2.92,1.4 6.73,1.4 6.99,1.65 8.64,1.65 IC9.9 10.54,2.16 12.06,3.68 12.06,7.87 v12.45,8.26
A18  (via drill 0.25)
  Top 0.203: v18.16,5.08 19.18,6.1 RN3.8 | v13.97,2.79 5.71,2.79 JP1.50
  Bottom 0.203: v18.16,5.08 18.16,4.83 16.76,3.43 IC9.7 14.86,3.05 14.22,3.05 v13.97,2.79
A19  (via drill 0.25)
  Top 0.203: v14.35,3.81 RN3.9 | v13.46,4.7 5.71,4.7 JP1.48
  Bottom 0.203: IC9.6 14.86,4.19 14.35,4.19 v14.35,3.81 v13.46,4.7
A20  (via drill 0.25)
  Top 0.203: JP1.46 v23.88,7.62 | 83.06,10.41 85.72,10.41 86.49,11.18 IC7.4 | 83.06,10.41 79.38,10.41 75.82,6.86 IC4.2 | 83.06,10.41 81.03,12.45 53.59,12.45 53.21,12.06 48.51,12.06 48.13,11.68 IC2.9 | v38.99,3.43 26.67,3.43 26.54,3.56 IC1.20
  Bottom 0.203: v23.88,7.62 23.88,4.95 24.51,4.32 IC1.20 | v38.99,3.43 39.62,2.79 45.47,2.79 45.47,10.29 46.1,10.92 IC2.9
A21  (via drill 0.25)
  Top 0.203: IC2.10 48.13,9.14 52.58,9.14 53.34,9.91 57.78,9.91 58.55,9.14 IC4.26 60.83,9.14 63.88,9.14 v65.15,10.41 | v1.4,3.17 1.4,8 2.16,8.76 2.67,8.76 3.05,9.14 3.81,9.14 4.45,9.78 JP1.44
  Bottom 0.203: IC2.10 47.88,9.4 48.51,10.03 48.51,12.45 45.97,12.45 44.96,11.43 44.96,4.06 41.78,4.06 IC1.21 39.75,4.32 39.75,4.45 38.35,4.45 37.85,3.94 37.85,0.89 23.88,0.89 22.86,1.91 22.86,2.54 14.48,2.54 14.35,2.41 14.35,0.76 2.79,0.76 1.4,2.16 v1.4,3.17 | v65.15,10.41 76.07,10.41 79.12,13.46 IC7.28
A22  (via drill 0.25)
  Top 0.203: v13.59,12.83 5.71,12.83 JP1.42 | IC2.11 IC1.22 | IC7.3 86.49,8.64 83.19,5.33 77.34,5.33 76.07,4.06 IC4.1 73.79,3.56 73.03,2.79 50.93,2.79 49.47,4.25 | 49.47,4.25 v49.28,4.45 | v22.23,4.45 24.26,2.41 47.62,2.41 49.47,4.25
  Bottom 0.203: IC8.5 14.22,18.41 13.72,17.91 13.72,16.38 13.84,16.26 13.84,15.62 13.59,15.37 v13.59,12.83 13.59,5.84 14.86,5.84 IC9.5 18.29,5.71 19.18,4.83 22.23,4.83 v22.23,4.45 | v49.28,4.45 47.88,5.84 IC2.11
A23  (via drill 0.25)
  Top 0.203: IC7.31 78.87,6.1 77.47,6.1 76.71,5.33 57.02,5.33 55.75,4.06 IC2.13 53.47,4.06 52.45,5.08 v43.43,5.08 | v13.84,19.81 8.89,19.81 v5.97,16.89 | v22.23,5.71 23.5,6.99 24,6.99 24.89,7.87 38.73,7.87 39.5,8.64 IC1.23 | v7.75,14.48 6.1,14.48 5.71,14.86 JP1.40 | v6.22,8.38 v7.75,9.91 | v7.37,6.99 8,6.35 14.1,6.35 v14.22,6.48
  Bottom 0.203: v13.84,19.81 14.86,19.81 IC8.4 | v5.97,16.89 5.46,16.38 5.46,15.88 JP1.40 | v22.23,5.71 22.23,5.33 19.3,5.33 18.03,6.6 18.03,6.73 16.76,6.73 IC9.4 14.86,6.73 14.86,6.48 v14.22,6.48 | v7.75,14.48 7.62,14.35 7.62,10.03 v7.75,9.91 | v6.22,8.38 7.37,7.24 v7.37,6.99 | v43.43,5.08 42.16,6.35 42.16,7.75 41.53,8.38 IC1.23
BA  (via drill 0.25)
  Top 0.203: v2.29,57.15 1.4,56.26 1.4,51.44 2.16,51.44 JP1.11
  Bottom 0.203: v2.29,57.15 5.33,57.15 9.27,61.09 9.27,61.98 17.78,61.98 22.35,57.4 22.35,51.05 25.91,51.05 28.07,48.9 28.07,41.66 26.29,39.88 IC1.6
BS  (via drill 0.25)
  Top 0.203: v6.35,54.48 v19.94,54.48
  Bottom 0.203: v19.94,54.48 21.84,52.58 21.84,48.51 25.91,48.51 27.56,46.86 27.56,43.69 26.29,42.42 IC1.5 | v6.35,54.48 2.92,54.48 2.92,53.98 JP1.9
CTSB  (via drill 0.25)
  Top 0.203: v70.23,57.28 54.99,57.28 54.61,56.9 45.59,56.9 44.96,57.53 RN2.2
  Bottom 0.203: IC5.9 70.87,49.4 70.87,56.64 v70.23,57.28 70.1,57.4 70.1,65.53 84.58,65.53 86.23,63.88 JP2.6
D0  (via drill 0.25)
  Top 0.203: v8.13,30.1 6.6,31.62 v6.35,31.62 | IC7.13 86.49,34.04 82.68,30.23 76.83,30.23 76.07,29.46 IC4.11 73.79,29.46 73.03,30.23 42.55,30.23 41.78,29.46 IC1.31 39.5,29.46 36.7,29.46 v33.78,32.38 | v80.01,61.47 77.85,61.47 76.71,62.61 IC5.18 | v16.26,40.77 5.71,40.77 JP1.20 | v16.51,56.13 16.76,56.39 v27.05,56.39
  Bottom 0.203: v8.13,30.1 8.13,29.84 10.92,29.84 11.05,29.72 11.05,26.04 10.29,26.04 8.26,24 8.26,22.86 8.64,22.48 IC8.15 | v6.35,31.62 6.22,31.75 6.22,39.24 5.46,40.01 JP1.20 | v80.01,61.47 85.72,55.75 85.72,52.96 86.74,51.94 89.53,51.94 89.53,35.81 88.52,34.8 IC7.13 | v16.26,40.77 16.51,41.02 v16.51,56.13 | v27.05,56.39 33.78,56.39 v33.78,32.38
D1  (via drill 0.25)
  Top 0.203: IC4.12 76.07,32 77.09,33.02 82.93,33.02 86.49,36.58 IC7.14 | v13.34,36.83 12.57,37.59 5.59,37.59 JP1.22 | v13.46,30.35 30.99,30.35 34.04,27.3 39.12,27.3 39.5,26.92 IC1.30 | v73.28,39.5 42.8,39.5 41.27,37.97 v38.61,37.97
  Bottom 0.203: 74.68,39.5 74.68,39.12 76.45,37.34 76.45,32.89 75.82,32.26 IC4.12 | 74.68,39.5 74.68,61.59 73.91,62.36 IC5.19 | 13.34,30.35 v13.34,36.83 | 13.34,30.35 13.34,29.72 13.59,29.46 13.59,25.02 14.86,23.75 IC8.1 | 13.34,30.35 v13.46,30.35 | v73.28,39.5 74.68,39.5 | v38.61,37.97 38.61,28.32 39.75,27.18 IC1.30
D2  (via drill 0.25)
  Top 0.203: v12.7,35.94 12.57,36.07 5.59,36.07 JP1.24 | v43.56,25.02 42.42,25.02 41.78,24.38 IC1.29 | v44.2,33.91 45.34,35.05 58.42,35.05 58.67,35.31 73.03,35.31 73.09,35.24 | 73.09,35.24 73.79,34.54 IC4.13 76.07,34.54 76.83,35.31 82.68,35.31 86.49,39.12 IC7.15 | v73.28,37.85 73.28,35.31 73.15,35.31 73.09,35.24 | v17.02,59.44 25.65,59.44 26.16,59.94 v36.2,59.94
  Bottom 0.203: IC8.2 14.86,22.48 13.08,24.26 13.08,29.34 12.83,29.59 12.83,35.81 v12.7,35.94 12.7,43.69 12.95,43.94 12.95,55.37 v17.02,59.44 | v43.56,25.02 44.2,25.65 v44.2,33.91 43.94,34.16 43.94,50.8 40.89,53.85 40.89,59.94 v36.2,59.94 | v73.28,37.85 72.64,38.48 72.64,61.09 71.37,62.36 IC5.20
D3  (via drill 0.25)
  Top 0.203: v14.22,20.45 14.48,20.19 v18.54,20.19 | v22.23,20.19 22.61,20.57 30.61,20.57 | 30.61,20.57 38.73,20.57 39.5,21.34 IC1.28 | v60.71,40.13 62.23,41.66 66.67,41.66 | 66.67,41.66 78.87,41.66 IC7.17 | 66.67,41.66 v69.6,44.58 | 30.61,35.56 57.53,35.56 58.55,36.58 IC4.15 | 30.61,35.56 19.56,35.56 18.8,34.8 7.11,34.8 5.71,33.4 JP1.26 | 30.61,20.57 v30.61,22.23 | v30.61,35.69 30.61,35.56
  Bottom 0.203: v14.22,20.45 14.22,20.7 14.86,20.7 IC8.3 | v18.54,20.19 v22.23,20.19 | v60.71,40.13 60.71,37.47 60.58,37.34 IC4.15 | v69.6,44.58 69.6,61.59 68.83,62.36 IC5.21 | v30.61,22.23 v30.61,35.69
D4  (via drill 0.25)
  Top 0.203: v5.84,11.68 v8.26,11.68 | v4.32,11.68 4.19,11.56 2.16,11.56 0.76,12.95 0.76,28.96 v1.78,28.96 | v46.35,22.99 46.48,23.11 51.56,23.11 53.59,25.15 56.39,25.15 56.77,24.77 v58.17,24.77 | v61.09,35.94 64.01,38.86 78.61,38.86 78.87,39.12 IC7.18 | v79.38,60.83 68.33,60.83 66.55,62.61 IC5.22 65.53,64.39 64.9,65.02 62.48,65.02 62.48,62.99 61.47,61.98 50.29,61.98 50.16,62.1 49.91,62.1 49.02,61.21 18.03,61.21 v17.91,61.09 | v7.37,42.04 9.14,43.81 11.94,43.81 v12.06,43.69
  Bottom 0.203: v8.26,11.68 8.26,10.16 8.64,9.78 IC9.15 | v5.84,11.68 5.59,11.68 5.46,11.56 4.32,11.56 v4.32,11.68 | v1.78,28.96 2.03,28.96 2.41,29.34 3.05,29.34 4.45,30.73 JP1.28 4.7,31.11 3.94,31.88 3.94,41.02 4.95,42.04 v7.37,42.04 | v46.35,22.99 43.18,19.81 43.18,15.49 39.62,15.49 39.12,16 39.12,17.91 39.75,18.54 IC1.27 | v58.17,24.77 59.05,25.65 60.71,25.65 61.85,26.8 61.85,33.02 60.83,34.04 IC4.16 60.58,34.8 60.58,35.43 v61.09,35.94 | v79.38,60.83 80.26,59.94 80.26,43.69 81.53,42.42 81.53,40.51 80.9,39.88 IC7.18 | v12.06,43.69 12.45,44.07 12.45,55.63 v17.91,61.09
D5  (via drill 0.25)
  Top 0.203: v17.14,24.64 15.37,26.42 8.76,26.42 7.62,27.56 5.71,27.56 JP1.30 4.45,28.32 3.43,29.34 2.16,29.34 0.51,30.99 0.51,65.41 46.1,65.41 v46.35,65.15 | v42.29,30.73 57.78,30.73 58.55,31.5 IC4.17 60.83,31.5 61.59,30.73 75.95,30.73 v76.96,31.75 | v50.04,61.47 61.85,61.47 62.99,62.61 IC5.23
  Bottom 0.203: v17.14,24.64 17.14,11.43 16.76,11.05 IC9.1 | v42.29,30.73 42.29,17.78 41.53,17.02 IC1.26 | v76.96,31.75 76.96,34.16 79.12,36.32 IC7.19 | IC5.23 63.25,62.36 61.98,61.09 61.98,42.16 58.17,38.35 58.17,32.89 58.8,32.26 IC4.17 | v46.35,65.15 v50.04,61.47
D6  (via drill 0.25)
  Top 0.203: IC4.18 v73.28,29.21 | v14.35,11.43 16,13.08 19.3,13.08 19.68,12.7 v27.56,12.7 38.48,12.7 39.5,13.72 IC1.25 | v1.27,43.43 2.16,44.32 16.89,44.32 17.65,43.56 19.3,43.56 19.43,43.43 22.1,43.43 22.48,43.81 v23.37,43.81 | v57.78,40.39 36.58,40.39 35.18,38.99 v27.05,38.99
  Bottom 0.203: 57.66,40.39 57.66,44.45 59.94,46.74 59.94,61.59 60.71,62.36 IC5.24 | 57.66,40.39 57.66,32.77 58.17,32.26 58.17,30.35 58.8,29.72 IC4.18 | v73.28,29.21 73.28,30.23 76.2,30.23 77.6,31.62 77.6,32.26 79.12,33.78 IC7.20 | v14.35,11.43 14.35,10.29 14.86,9.78 IC9.2 | v1.27,43.43 0.51,42.67 0.51,26.8 2.67,26.8 3.68,25.78 4.45,25.78 JP1.32 | v23.37,43.81 23.88,43.31 23.88,38.35 | 23.88,38.35 23.88,36.32 24.89,35.31 27.56,35.31 v27.56,12.7 | v57.78,40.39 57.66,40.39 | v27.05,38.99 26.42,38.35 23.88,38.35
D7  (via drill 0.25)
  Top 0.203: v17.14,8.89 17.78,9.53 18.92,9.53 19.81,10.41 v21.84,10.41 38.48,10.41 39.24,11.18 39.5,11.18 IC1.24 | v12.57,19.18 12.7,19.05 v18.54,19.05 | v12.32,22.86 JP1.34 | v76.58,28.83 75.44,27.69 61.59,27.69 60.83,26.92 IC4.19 58.55,26.92 57.78,27.69 50.04,27.69 v49.66,27.3
  Bottom 0.203: v17.14,8.89 16.76,8.51 IC9.3 | v12.32,22.86 12.57,22.61 v12.57,19.18 | v18.54,19.05 18.8,18.8 18.8,18.54 19.81,17.53 21.84,17.53 v21.84,10.41 | IC5.25 58.17,62.36 57.15,61.34 57.15,32.13 57.66,31.62 57.66,28.32 58.8,27.18 IC4.19 | v76.58,28.83 76.58,28.96 78.99,31.37 IC7.21 | v49.66,27.3 49.66,20.57 46.48,20.57 45.47,19.56 45.47,18.16 45.97,18.16 46.1,18.03 47.5,18.03 48.51,17.02 48.51,15.49 45.59,15.49 41.78,11.68 IC1.24
DCDB  (via drill 0.25)
  Top 0.203: v75.31,55.88 67.44,55.88 67.18,56.13 55.12,56.13 54.86,55.88 41.53,55.88 39.88,57.53 RN2.4
  Bottom 0.203: v75.31,55.88 78.74,59.31 78.74,60.96 IC5.16
DSRB  (via drill 0.25)
  Top 0.203: v73.28,56.52 70.99,56.52 70.87,56.64 54.99,56.64 54.74,56.39 43.56,56.39 42.42,57.53 RN2.3
  Bottom 0.203: v73.28,56.52 73.15,56.64 73.15,61.98 72.64,62.48 72.64,64.52 73.15,65.02 78.49,65.02 78.49,64.64 IC5.17
ECLK  (via drill 0.25)
  Top 0.203: v43.56,32.38 45.47,32.38 45.85,32 IC2.1 48.13,32 51.05,32 51.82,32.77 55.24,32.77 v55.5,33.02 | v15.62,48.64 5.71,48.64 JP1.14 | v18.92,60.07 19.43,60.58 v54.61,60.58
  Bottom 0.203: v43.56,32.38 42.16,33.78 42.16,35.69 41.53,36.32 IC1.34 | v55.5,33.02 55.5,41.27 54.61,42.16 v54.61,60.58 54.61,61.34 53.59,62.36 IC5.27 | v15.62,48.64 15.88,48.9 15.88,57.02 v18.92,60.07
GND  (via drill 0.3)
  Top 0.61: v16.51,13.72 17.4,14.61 v17.78,14.61 | C7.2 6.99,63.5 5.71,64.77 4.06,64.77 3.17,63.88 JP1.1 | v28.19,28.07 v21.59,28.07 | IC4.14 76.07,37.08 77.22,38.23 83.06,38.23 86.49,41.66 IC7.16 | v22.23,1.65 22.86,1.02 v47.62,1.02
  Bottom 0.61: v16.51,13.72 16.51,14.35 IC8.8 | v17.78,14.61 17.78,21.97 18.1,22.29 | 18.1,22.29 19.43,23.62 RN3.1 21.21,24.64 21.59,25.02 v21.59,28.07 | IC3.7 16.76,26.42 17.91,25.27 17.91,22.48 18.1,22.29 | 24.51,63.63 24.51,62.61 R2.1 25.02,61.85 25.02,52.58 IC1.1 26.29,51.56 28.7,49.15 28.7,40.51 29.46,39.75 29.46,37.34 29.59,37.21 C3.2 29.72,36.45 29.72,29.59 v28.19,28.07 | 24.51,63.63 24.51,63.88 18.41,63.88 18.29,63.75 13.21,63.75 C7.2 | 24.51,63.63 42.16,63.63 46.48,59.31 RN2.1 47.24,57.28 50.55,53.98 50.55,49.4 IC5.1 50.55,47.12 49.15,45.72 49.15,44.83 C8.2 49.15,44.07 49.28,43.94 49.28,43.18 49.91,42.55 49.91,42.29 C2.1 50.93,41.53 50.93,40.77 51.56,40.13 IC6.1 52.45,39.24 52.45,37.21 C11.2 C1.1 49.91,36.45 49.91,32.13 C4.1 50.42,31.37 50.42,13.46 50.04,13.08 50.04,1.14 | IC4.14 73.79,37.08 70.23,37.08 70.23,37.97 C10.1 69.47,38.48 65.15,38.48 C9.1 64.39,37.97 64.39,4.19 C6.1 64.14,3.43 64.14,2.67 | IC7.16 JP2.1 | 64.14,2.67 64.14,1.78 63.5,1.14 50.04,1.14 | 47.88,1.14 50.04,1.14 | 47.88,1.14 47.88,3.3 IC2.12 | C5.1 84.2,3.43 84.07,3.3 84.07,3.05 83.69,2.67 64.14,2.67 | v22.23,1.65 16.76,1.65 IC9.8 | v47.62,1.02 47.88,1.14
N$2
  Bottom 0.203: PWR.K R2.2
N$20
  Bottom 0.203: C9.2 64.77,42.67 Q2.2 64.64,43.69 64.64,46.23 63.75,47.12 IC5.6
N$21
  Bottom 0.203: C10.2 69.85,42.67 Q2.1 69.47,43.69 69.47,43.94 66.29,47.12 IC5.7
NYB1  (via drill 0.25)
  Top 0.203: v18.16,27.69 18.41,27.43 23.75,27.43 v23.88,27.3 | v26.92,17.4 39.62,17.4 39.75,17.53 45.09,17.53 45.85,16.76 IC2.7
  Bottom 0.203: v18.16,27.69 16.76,27.69 IC3.6 | v23.88,27.3 23.88,21.08 24.89,20.07 26.92,20.07 v26.92,17.4
NYB2  (via drill 0.25)
  Top 0.203: v8.64,25.78 7.75,24.89 6.48,24.89 v6.1,24.51 | v7.37,3.43 13.21,3.43 14.22,4.45 18.92,4.45 19.56,5.08 42.67,5.08 43.31,5.71 v43.81,5.71
  Bottom 0.203: v8.64,25.78 8.64,26.42 IC3.8 | v6.1,24.51 6.22,24.38 6.22,22.48 5.21,21.46 3.68,21.46 3.68,7.49 4.95,6.22 7.37,6.22 v7.37,3.43 | v43.81,5.71 44.2,6.1 44.2,11.56 46.1,13.46 IC2.8
QCLK  (via drill 0.25)
  Top 0.203: v34.54,48.9 32.38,51.05 17.02,51.05 16.51,51.56 6.1,51.56 5.71,51.18 JP1.12
  Bottom 0.203: v34.54,48.9 38.23,45.21 38.23,41.4 39.75,39.88 IC1.35
R//W  (via drill 0.25)
  Top 0.203: v7.11,44.96 7.24,44.83 v17.14,44.83 | v17.65,40.01 19.3,38.35 22.35,38.35 24.38,40.39 34.29,40.39 v35.05,39.62 | v35.94,32.38 36.32,32 39.5,32 IC1.32
  Bottom 0.203: IC1.32 41.78,31.5 42.93,31.5 42.93,24.64 43.43,24.13 45.47,24.13 45.47,28.07 46.1,28.7 IC2.2 | v7.11,44.96 5.71,43.56 JP1.18 | v17.14,44.83 17.65,44.32 v17.65,40.01 | v35.05,39.62 35.94,38.73 v35.94,32.38
RTSB
  Top 0.203: IC5.8 69.09,49.15 72.9,52.96 86.23,52.96 JP2.2
RXD  (via drill 0.25)
  Top 0.203: JP2.4 86.23,58.04 79.76,58.04 v79.38,57.66 79.25,57.78 75.31,57.78 73.15,59.94 37.97,59.94 37.34,59.31 RN2.5
  Bottom 0.203: v79.38,57.66 79.38,49.78 78.99,49.4 IC5.12
TXD  (via drill 0.25)
  Top 0.203: v74.04,59.82 74.42,60.2 85.85,60.2 86.23,60.58 JP2.5
  Bottom 0.203: v74.04,59.82 74.04,49.53 73.91,49.4 IC5.10
VCC  (via drill 0.3)
  Top 0.61: v10.41,11.68 10.92,12.19 v11.68,12.19 | v22.73,36.2 23.11,36.58 24.26,36.58 IC1.7 | v11.68,30.1 12.7,31.11 18.8,31.11 19.18,31.5 RN1.1 | PWR.A 18.54,61.98 18.41,61.85 13.84,61.85 13.21,61.21 C7.1 | v5.84,46.99 6.73,47.88 v9.65,47.88 | v14.99,38.23 v10.92,38.23 | v63.25,2.16 77.47,2.16 78.87,3.56 IC7.32 | v53.98,55.12 85.85,55.12 86.23,55.5 JP2.3 | v57.02,4.45 58.17,4.45 58.55,4.06 IC4.28 | v57.02,31.37 56.9,31.5 56.26,31.5 | 56.26,31.5 55.75,31.5 IC2.24 | v28.83,33.91 29.59,33.15 51.31,33.15 51.94,33.78 55.88,33.78 56.26,33.4 56.26,31.5
  Bottom 0.61: v10.41,11.68 10.41,11.05 IC9.16 | v11.68,12.19 11.68,22.35 10.54,23.5 | 10.54,23.5 IC8.16 | IC1.7 C3.1 28.83,36.45 v28.83,33.91 | 18.54,34.8 18.54,33.15 19.43,32.26 RN1.1 | 18.54,34.8 19.43,35.69 22.73,35.69 v22.73,36.2 | v11.68,30.1 11.68,24.77 10.67,23.75 10.54,23.5 | 10.67,47.88 10.67,58.67 12.45,60.45 C7.1 | 10.67,38.23 10.67,47.88 | 10.67,38.23 10.67,34.67 10.54,34.54 IC3.14 | v5.84,46.99 4.06,46.99 3.17,47.88 JP1.13 | 10.67,47.88 v9.65,47.88 | v14.99,38.23 18.29,34.92 18.54,34.8 | v10.92,38.23 10.67,38.23 | IC4.28 C6.2 63.12,3.43 63.25,3.3 v63.25,2.16 | 81.79,3.81 C5.2 | IC7.32 81.79,3.81 | IC7.30 80.9,8.38 81.79,7.49 81.79,3.81 | IC5.15 84.07,62.36 85.6,60.83 85.6,57.4 86.49,56.52 JP2.3 | 51.12,45.02 53.09,46.99 53.09,47.12 IC5.2 53.59,49.4 53.59,54.74 v53.98,55.12 | 51.12,45.02 50.93,44.83 C8.1 | C4.2 IC2.24 54.23,32.26 54.23,36.45 C11.1 54.23,37.21 54.23,40.26 IC6.3 53.85,41.02 53.85,42.29 51.12,45.02 | v57.02,31.37 v57.02,4.45
X1  (via drill 0.25)
  Top 0.203: v45.09,47.37 43.69,47.37 41.78,49.28 IC1.39
  Bottom 0.203: C2.2 46.23,41.91 Q1.1 45.47,42.29 45.47,46.99 v45.09,47.37
X2  (via drill 0.25)
  Top 0.203: v42.93,38.86 44.58,37.21 45.21,37.21 Q1.2
  Bottom 0.203: C1.2 46.23,36.83 Q1.2 | v42.93,38.86 42.93,45.09 41.53,46.48 IC1.38

### Text on the board
bPlace: pugbutt.com 2022 | HD63C09 FUN V0.1